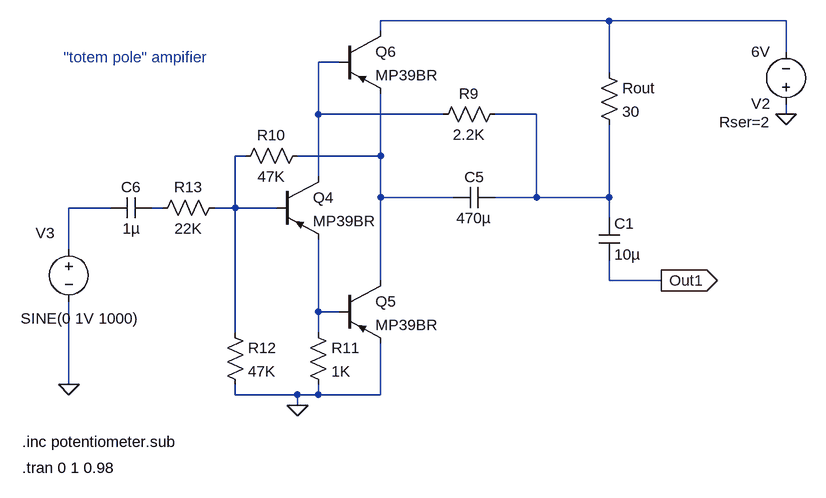
[diagram p0: schematic headamp1.asc]
headamp1.asc, the LTspice schematic file:
Version 4
SHEET 1 880 680
WIRE 368 -816 16 -816
WIRE 640 -816 368 -816
WIRE 16 -800 16 -816
WIRE 640 -768 640 -816
WIRE -48 -752 -80 -752
WIRE 368 -736 368 -816
WIRE -80 -672 -80 -752
WIRE 112 -672 -80 -672
WIRE 256 -672 192 -672
WIRE 640 -672 640 -688
WIRE -192 -608 -208 -608
WIRE 16 -608 16 -704
WIRE 16 -608 -112 -608
WIRE -80 -576 -80 -672
WIRE 16 -544 16 -608
WIRE 128 -544 16 -544
WIRE 256 -544 256 -672
WIRE 256 -544 192 -544
WIRE 368 -544 368 -656
WIRE 368 -544 256 -544
WIRE -400 -528 -464 -528
WIRE -320 -528 -336 -528
WIRE -208 -528 -208 -608
WIRE -208 -528 -240 -528
WIRE -144 -528 -208 -528
WIRE 368 -512 368 -544
WIRE -464 -464 -464 -528
WIRE 16 -416 16 -544
WIRE 368 -416 368 -448
WIRE 448 -416 368 -416
WIRE -80 -368 -80 -480
WIRE -48 -368 -80 -368
WIRE -208 -336 -208 -528
WIRE -80 -336 -80 -368
WIRE -464 -256 -464 -384
WIRE -208 -240 -208 -256
WIRE -112 -240 -208 -240
WIRE -80 -240 -80 -256
WIRE -80 -240 -112 -240
WIRE 16 -240 16 -320
WIRE 16 -240 -80 -240
WIRE -112 -224 -112 -240
FLAG 640 -672 0
FLAG -112 -224 0
FLAG 448 -416 Out1
IOPIN 448 -416 Out
FLAG -464 -256 0
SYMBOL voltage 640 -672 R180
WINDOW 123 0 0 Left 2
WINDOW 39 24 -12 Left 2
SYMATTR SpiceLine Rser=2
SYMATTR InstName V2
SYMATTR Value 6V
SYMBOL pnp -144 -576 R0
SYMATTR InstName Q4
SYMATTR Value MP39BR
SYMBOL pnp -48 -416 R0
SYMATTR InstName Q5
SYMATTR Value MP39BR
SYMBOL pnp -48 -800 R0
SYMATTR InstName Q6
SYMATTR Value MP39BR
SYMBOL cap 192 -560 R90
WINDOW 0 0 32 VBottom 2
WINDOW 3 32 32 VTop 2
SYMATTR InstName C5
SYMATTR Value 470µ
SYMBOL res 208 -688 R90
WINDOW 0 0 56 VBottom 2
WINDOW 3 32 56 VTop 2
SYMATTR InstName R9
SYMATTR Value 2.2K
SYMBOL res -96 -624 R90
WINDOW 0 0 56 VBottom 2
WINDOW 3 32 56 VTop 2
SYMATTR InstName R10
SYMATTR Value 47K
SYMBOL res -96 -352 R0
SYMATTR InstName R11
SYMATTR Value 1K
SYMBOL res -224 -352 R0
SYMATTR InstName R12
SYMATTR Value 47K
SYMBOL res -224 -544 R90
WINDOW 0 0 56 VBottom 2
WINDOW 3 32 56 VTop 2
SYMATTR InstName R13
SYMATTR Value 22K
SYMBOL cap -336 -544 R90
WINDOW 0 0 32 VBottom 2
WINDOW 3 32 32 VTop 2
SYMATTR InstName C6
SYMATTR Value 1µ
SYMBOL voltage -464 -480 R0
WINDOW 39 -112 95 Left 2
WINDOW 3 -74 122 Left 2
WINDOW 0 -51 -9 Left 2
SYMATTR Value SINE(0 1V 1000)
SYMATTR InstName V3
SYMATTR Value2 AC 1
SYMBOL res 352 -752 R0
SYMATTR InstName Rout
SYMATTR Value 30
SYMBOL cap 352 -512 R0
SYMATTR InstName C1
SYMATTR Value 10µ
TEXT -536 -128 Left 2 !.tran 0 1 0.98
TEXT -536 -168 Left 2 !.inc potentiometer.sub
TEXT -472 -760 Left 2 ;"totem pole" ampifier

The netlist it stands for:
* headamp1.asc
V2 0 N001 6V Rser=2
Q4 N002 N004 N008 0 MP39BR
Q5 N005 N008 0 0 MP39BR
Q6 N001 N002 N005 0 MP39BR
C5 N003 N005 470µ
R9 N003 N002 2.2K
R10 N005 N004 47K
R11 N008 0 1K
R12 N004 0 47K
R13 N004 N007 22K
C6 N007 N006 1µ
V3 N006 0 SINE(0 1V 1000) AC 1
Rout N001 N003 30
C1 N003 Out1 10µ
.model NPN NPN
.model PNP PNP
.lib standard.bjt
.tran 0 1 0.98
.inc potentiometer.sub
* "totem pole" ampifier
.backanno
.end